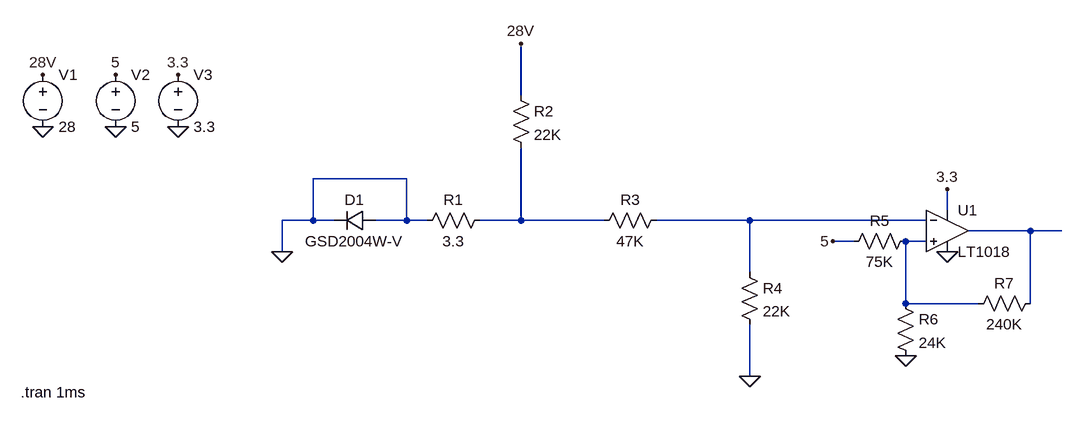
[diagram p0: schematic WHC_Input_Stage.asc]
WHC_Input_Stage.asc, the LTspice schematic file:
Version 4
SHEET 1 1236 712
WIRE 400 240 400 160
WIRE 224 368 80 368
WIRE 1056 416 1056 384
WIRE 80 432 80 368
WIRE 80 432 32 432
WIRE 112 432 80 432
WIRE 224 432 224 368
WIRE 224 432 176 432
WIRE 256 432 224 432
WIRE 400 432 400 320
WIRE 400 432 336 432
WIRE 528 432 400 432
WIRE 752 432 608 432
WIRE 1024 432 752 432
WIRE 1184 448 1088 448
WIRE 1232 448 1184 448
WIRE 912 464 880 464
WIRE 1024 464 992 464
WIRE 32 480 32 432
WIRE 752 512 752 432
WIRE 992 560 992 464
WIRE 1104 560 992 560
WIRE 1184 560 1184 448
WIRE 752 672 752 592
FLAG 32 480 0
FLAG 752 672 0
FLAG 400 160 28V
FLAG -336 208 28V
FLAG -336 288 0
FLAG 1056 480 0
FLAG 992 640 0
FLAG 880 464 5
FLAG 1056 384 3.3
FLAG -224 288 0
FLAG -128 288 0
FLAG -224 208 5
FLAG -128 208 3.3
SYMBOL diode 176 416 R90
WINDOW 0 0 32 VBottom 2
WINDOW 3 32 32 VTop 2
SYMATTR InstName D1
SYMATTR Value GSD2004W-V
SYMBOL res 240 448 R270
WINDOW 0 32 56 VTop 2
WINDOW 3 0 56 VBottom 2
SYMATTR InstName R1
SYMATTR Value 3.3
SYMATTR SpiceLine tol=1 pwr=0.1
SYMBOL res 384 224 R0
SYMATTR InstName R2
SYMATTR Value 22K
SYMATTR SpiceLine tol=1 pwr=0.1
SYMBOL res 512 448 R270
WINDOW 0 32 56 VTop 2
WINDOW 3 0 56 VBottom 2
SYMATTR InstName R3
SYMATTR Value 47K
SYMATTR SpiceLine tol=1 pwr=0.1
SYMBOL res 736 496 R0
SYMATTR InstName R4
SYMATTR Value 22K
SYMATTR SpiceLine tol=1 pwr=0.1
SYMBOL voltage -336 192 R0
WINDOW 123 0 0 Left 2
WINDOW 39 0 0 Left 2
SYMATTR InstName V1
SYMATTR Value 28
SYMBOL Comparators\\LT1018 1056 448 R0
SYMATTR InstName U1
SYMBOL res 896 480 R270
WINDOW 0 32 56 VTop 2
WINDOW 3 0 56 VBottom 2
SYMATTR InstName R5
SYMATTR Value 75K
SYMATTR SpiceLine tol=1 pwr=0.1
SYMBOL res 976 544 R0
SYMATTR InstName R6
SYMATTR Value 24K
SYMATTR SpiceLine tol=1 pwr=0.1
SYMBOL res 1200 544 R90
WINDOW 0 0 56 VBottom 2
WINDOW 3 32 56 VTop 2
SYMATTR InstName R7
SYMATTR Value 240K
SYMATTR SpiceLine tol=1 pwr=0.1
SYMBOL voltage -224 192 R0
WINDOW 123 0 0 Left 2
WINDOW 39 0 0 Left 2
SYMATTR InstName V2
SYMATTR Value 5
SYMBOL voltage -128 192 R0
WINDOW 123 0 0 Left 2
WINDOW 39 0 0 Left 2
SYMATTR InstName V3
SYMATTR Value 3.3
TEXT -370 696 Left 2 !.tran 1ms

The netlist it stands for:
* WHC_Input_Stage.asc
D1 0 0 GSD2004W-V
R1 0 N001 3.3 tol=1 pwr=0.1
R2 28V N001 22K tol=1 pwr=0.1
R3 N001 N002 47K tol=1 pwr=0.1
R4 N002 0 22K tol=1 pwr=0.1
V1 28V 0 28
XU1 N004 N002 3.3 0 N003 LT1018  ; pins In+ In- V+ V- OUT
R5 5 N004 75K tol=1 pwr=0.1
R6 N004 0 24K tol=1 pwr=0.1
R7 N003 N004 240K tol=1 pwr=0.1
V2 5 0 5
V3 3.3 0 3.3
.model D D
.lib standard.dio
.tran 1ms
.lib LTC1.lib
.backanno
.end